# EAGLE design hall (EAGLE 9.6.2)
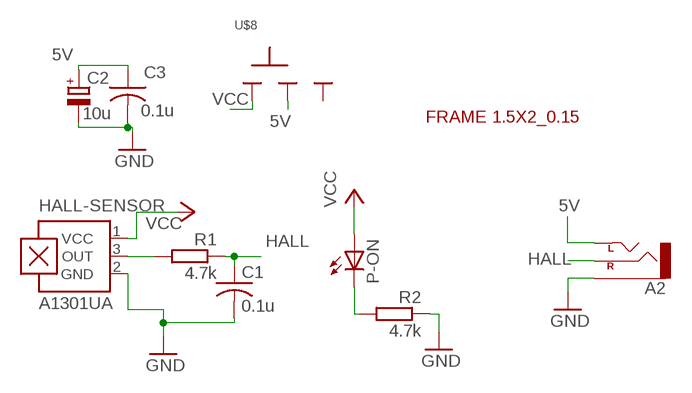
[diagram p0: schematic, sheet 1]

## Parts
A2  AUX-CONNECTOR_CEDT_JANUARY_2015_V5_AUDIO-JACKPTH  [AUX-CONNECTOR_CEDT_JANUARY_2015_V5_AUDIO-JACK]
C1  0.1u  C-US025-024X044  [C025-024X044]
C2  10u  CPOL-EUE2.5-5  [E2,5-5]
C3  0.1u  C-US025-024X044  [C025-024X044]
HALL-SENSOR  A1301UA  [SIP3-UA]
P-ON  LED3MM  [LED3MM]
R1  4.7k  R-EU_0204/7  [0204/7]
R2  4.7k  R-EU_0204/7  [0204/7]
U$1  FRAME_1.5X2_RAD_0.15  [FRAME_1.5X2_RAD_0.15]
U$8  SLIDESWITCH-BIG  [BIGSWITCH]

## Nets
5V: A2.TIP(LEFT) C2.+ C3.1 U$8.2
GND: A2.SLEEVE C1.2 C2.- C3.2 HALL-SENSOR.2(GND) R2.1
HALL: A2.RING(RIGHT) C1.1 R1.1
N$1: HALL-SENSOR.3(OUT) R1.2
N$8: P-ON.K(C) R2.2
VCC: HALL-SENSOR.1(VCC) P-ON.A U$8.1
Unconnected: U$8.3

## Library data of the parts
A2 = aux-connector:AUX-CONNECTOR_CEDT_JANUARY_2015_V5_AUDIO-JACK: 3.5mm Audio Jack Simple 3.5mm common PCB mount audio jack. SKU: PRT-08032
C1 C3 = rcl:C-US: CAPACITOR, American symbol; SPICEPREFIX: C
C2 = rcl:CPOL-EU: POLARIZED CAPACITOR, European symbol; SPICEPREFIX: C
HALL-SENSOR = allegro:A13*?: Linear Hall Effect Sensor ICs Continuous-Time Ratiometric High-Temperature Operation Programmable Linear with Analog Output A1302 -Replacement- UGN3503 Source: http://www.allegromicro.com/en/Products/Part_Numbers/1301/1301.pdf http://www.allegromicro.com/en/Products/Part_Numbers/1321/1321.pdf http://www.allegromicro.com/en/Products/Part_Numbers/1381/1381.pdf; MF: ALLEGRO MICROSYSTEMS, INC.; MPN: A1301EUA-T; OC_FARNELL: 1198085; OC_NEWARK: 31K6635
P-ON = CEDT_JANUARY_2015_v6:LED
R1 R2 = rcl:R-EU_: RESISTOR, European symbol; SPICEPREFIX: R
U$1 = CEDT_JANUARY_2015_v6:FRAME_1.5X2_RAD_0.15
U$8 = CEDT_JANUARY_2015_v6:SLIDESWITCH

## Board
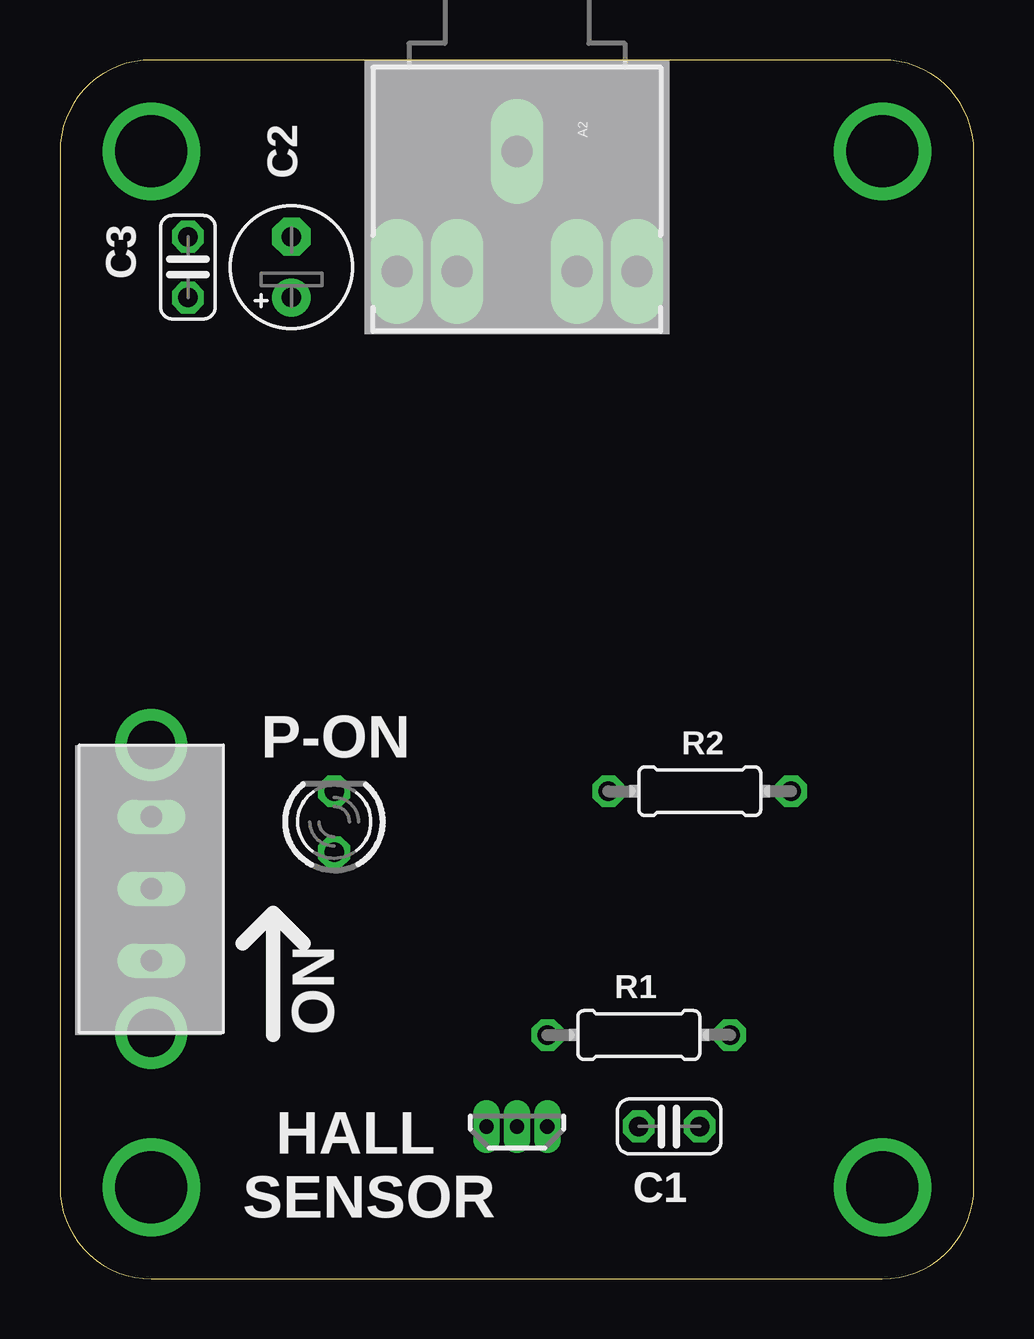
[diagram p1: board, top side]
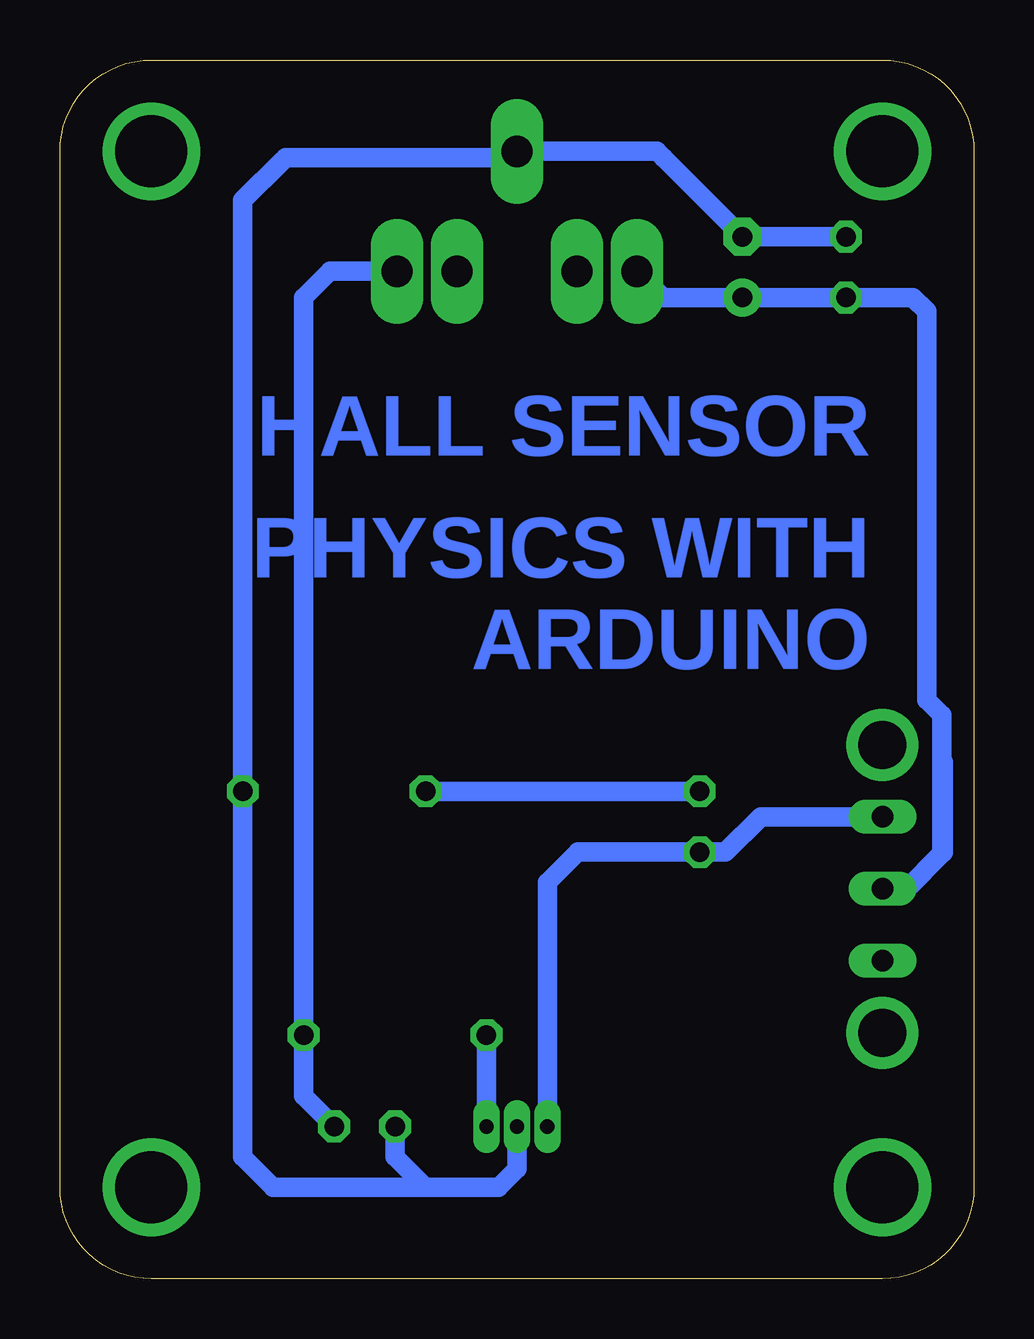
[diagram p2: board, bottom side, seen from below]

Size 38.1 x 50.8 mm. Coordinates in mm from the lower left corner, seen from the top.
Copper layers (1*16): Top 0.035mm / dielectric 1.5mm / Bottom 0.035mm
Design rules "default *": minimum track width 6mil, minimum drill 0.35mm, track to track 16mil, track to pad 16mil, pad to pad 16mil, via to via 16mil, smd to smd 16mil, copper to edge 30mil, drill to drill 6mil, minimum pad ring 10mil, minimum via ring 8mil, stop-mask expansion 4mil, vias tented up to drill 0mil, thermal gap 10mil

### Footprints (pad centres in the part's own frame; a part is rotated, then mirrored left to right if it is on the bottom)
AUX-CONNECTOR_CEDT_JANUARY_2015_V5_AUDIO-JACK = drill 1.3 pad 2.184 long: RING 5,5; RSH 5,2.5; SLEEVE 0,0; TIP 5,-5; TSH 5,-2.5
C025-024X044 = drill 0.813 octagon: 1 -1.27,0; 2 1.27,0
E2,5-5 = drill 0.813 pad 1.6: + -1.27,0 | drill 0.813 pad 1.6 octagon: - 1.27,0
SIP3-UA = drill 0.6 pad 0.7 long: 1 -1.27,0; 2 0,0; 3 1.27,0
LED3MM = drill 0.813 octagon: A -1.27,0; K 1.27,0
0204/7 = drill 0.813 octagon: 1 -3.81,0; 2 3.81,0
FRAME_1.5X2_RAD_0.15 = drill 2.997 pad 4.064: P$1 3.81,46.99; P$2 34.29,46.99; P$3 34.29,3.81; P$4 3.81,3.81
BIGSWITCH = drill 0.9 long: 1 -3,0; 2 0,0; 3 3,0 | drill 2 pad 2.184: TAB1 -6,0; TAB2 6,0

### Placement (x,y rotation side)
A2  19.05,46.99 270 top
C1  25.4,6.35 180 top
C2  9.65,42.16 90 top
C3  5.33,42.16 90 top
HALL-SENSOR  19.05,6.35 0 top
P-ON  11.43,19.05 90 top
R1  24.13,10.16 180 top
R2  26.67,20.32 180 top
U$1  0,0 0 top
U$8  3.81,16.26 270 top

### Tracks (layer width: path | path; a pad name or v marks a point on that pad's centre or on a via)
5V
  Bottom 0.813: 1.33,17.72 2.79,16.26 U$8.2 | 1.33,17.72 1.33,21.59 | 1.33,21.59 1.33,23.5 1.97,24.13 1.97,40.32 2.54,40.89 C3.1 C2.+ 12.95,40.89 A2.TIP | 1.33,17.72 1.28,17.77 1.28,21.54 1.33,21.59
GND
  Bottom 0.813: 19.05,4.57 19.05,5.08 HALL-SENSOR.2 19.05,4.57 | 22.86,3.81 29.21,3.81 30.48,5.08 R2.1 30.48,44.96 28.83,46.61 28.7,46.74 19.3,46.74 A2.SLEEVE 13.21,46.99 12.95,46.74 C2.- C3.2 | 22.86,3.81 19.81,3.81 19.05,4.57 | C1.2 24.13,5.08 22.86,3.81
HALL
  Bottom 0.813: C1.1 27.94,7.62 R1.1 27.94,11.43 27.94,40.89 26.84,41.99 A2.RING
N$1
  Bottom 0.813: HALL-SENSOR.3 R1.2
N$8
  Bottom 0.813: P-ON.K R2.2
VCC
  Bottom 0.813: 11.68,17.78 P-ON.A | 17.78,7.62 HALL-SENSOR.1 17.78,16.51 16.51,17.78 P-ON.A | U$8.1 8.89,19.26 10.37,17.78 P-ON.A

### Text on the board
Bottom: HALL SENSOR | PHYSICS WITH / ARDUINO
tNames: ON | HALL / SENSOR